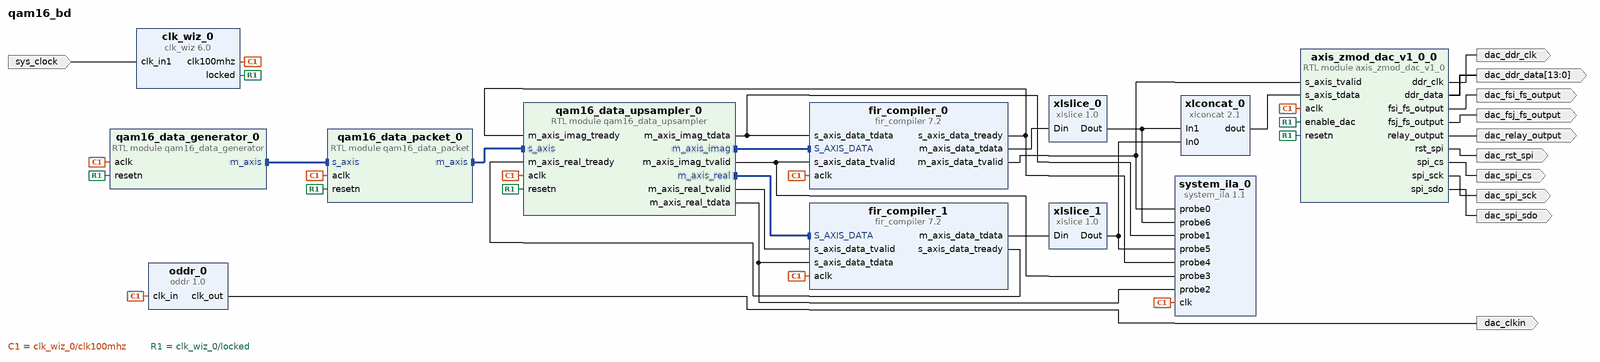
[diagram p0: block diagram of the top level]
# Vivado block design qam16_bd, xc7a100tcsg324-1, Vivado 2022.2
create_bd_design qam16_bd

create_bd_port -dir I -type clk sys_clock
set_property -dict {CONFIG.FREQ_HZ 100000000 CONFIG.PHASE 0.0} [get_bd_ports sys_clock]
create_bd_port -dir O -from 13 -to 0 dac_ddr_data
create_bd_port -dir O -type clk dac_ddr_clk
create_bd_port -dir O dac_rst_spi
create_bd_port -dir O dac_spi_sck
create_bd_port -dir O dac_spi_cs
create_bd_port -dir O dac_spi_sdo
create_bd_port -dir O dac_relay_output
create_bd_port -dir O dac_fsi_fs_output
create_bd_port -dir O dac_fsj_fs_output
create_bd_port -dir O -type clk dac_clkin

create_bd_cell -type ip -vlnv xilinx.com:ip:fir_compiler:7.2 fir_compiler_0
set_property -dict [list \
  CONFIG.BestPrecision true \
  CONFIG.Clock_Frequency 100 \
  CONFIG.CoefficientSource COE_File \
  CONFIG.Coefficient_File ../../../../../../../../../../../workspace/matlab/qam16/rcos_coeff.coe \
  CONFIG.Coefficient_Fractional_Bits 22 \
  CONFIG.Coefficient_Sets 1 \
  CONFIG.Coefficient_Sign Signed \
  CONFIG.Coefficient_Structure Inferred \
  CONFIG.Coefficient_Width 20 \
  CONFIG.Filter_Architecture Systolic_Multiply_Accumulate \
  CONFIG.Output_Rounding_Mode Full_Precision \
  CONFIG.Output_Width 39 \
  CONFIG.Quantization Quantize_Only \
  CONFIG.Sample_Frequency 0.1 \
] [get_bd_cells fir_compiler_0]
create_bd_cell -type ip -vlnv xilinx.com:ip:fir_compiler:7.2 fir_compiler_1
set_property -dict [list \
  CONFIG.BestPrecision true \
  CONFIG.Clock_Frequency 100 \
  CONFIG.CoefficientSource COE_File \
  CONFIG.Coefficient_File ../../../../../../../../../../../workspace/matlab/qam16/rcos_coeff.coe \
  CONFIG.Coefficient_Fractional_Bits 22 \
  CONFIG.Coefficient_Sets 1 \
  CONFIG.Coefficient_Sign Signed \
  CONFIG.Coefficient_Structure Inferred \
  CONFIG.Coefficient_Width 20 \
  CONFIG.Filter_Architecture Systolic_Multiply_Accumulate \
  CONFIG.Output_Rounding_Mode Full_Precision \
  CONFIG.Output_Width 39 \
  CONFIG.Quantization Quantize_Only \
  CONFIG.Sample_Frequency 0.1 \
] [get_bd_cells fir_compiler_1]
create_bd_cell -type ip -vlnv xilinx.com:ip:clk_wiz:6.0 clk_wiz_0
set_property -dict [list \
  CONFIG.CLK_IN1_BOARD_INTERFACE sys_clock \
  CONFIG.CLK_OUT1_PORT clk100mhz \
  CONFIG.USE_BOARD_FLOW true \
  CONFIG.USE_RESET false \
] [get_bd_cells clk_wiz_0]
create_bd_cell -type module -reference qam16_data_packet qam16_data_packet_0
create_bd_cell -type ip -vlnv xilinx.com:ip:system_ila:1.1 system_ila_0
set_property -dict [list \
  CONFIG.C_DATA_DEPTH 16384 \
  CONFIG.C_EN_STRG_QUAL 1 \
  CONFIG.C_MON_TYPE NATIVE \
  CONFIG.C_NUM_OF_PROBES 7 \
  CONFIG.C_PROBE0_TYPE 0 \
  CONFIG.C_PROBE1_TYPE 0 \
  CONFIG.C_PROBE2_TYPE 0 \
  CONFIG.C_PROBE3_TYPE 0 \
  CONFIG.C_PROBE4_TYPE 0 \
  CONFIG.C_PROBE5_TYPE 0 \
  CONFIG.C_PROBE6_TYPE 0 \
] [get_bd_cells system_ila_0]
create_bd_cell -type module -reference qam16_data_generator qam16_data_generator_0
create_bd_cell -type module -reference qam16_data_upsampler qam16_data_upsampler_0
set_property -dict {CONFIG.prescaler_factor 100} [get_bd_cells qam16_data_upsampler_0]
create_bd_cell -type ip -vlnv xilinx.com:ip:xlslice:1.0 xlslice_0
set_property -dict {CONFIG.DIN_FROM 36 CONFIG.DIN_TO 21 CONFIG.DIN_WIDTH 40} [get_bd_cells xlslice_0]
create_bd_cell -type ip -vlnv xilinx.com:ip:xlslice:1.0 xlslice_1
set_property -dict {CONFIG.DIN_FROM 36 CONFIG.DIN_TO 21 CONFIG.DIN_WIDTH 40} [get_bd_cells xlslice_1]
create_bd_cell -type ip -vlnv xilinx.com:ip:xlconcat:2.1 xlconcat_0
create_bd_cell -type ip -vlnv xilinx.com:ip:oddr:1.0 oddr_0
create_bd_cell -type module -reference axis_zmod_dac_v1_0 axis_zmod_dac_v1_0_0

# ---- connections ----

connect_bd_intf_net [get_bd_intf_pins qam16_data_generator_0/m_axis] [get_bd_intf_pins qam16_data_packet_0/s_axis]
connect_bd_intf_net [get_bd_intf_pins qam16_data_packet_0/m_axis] [get_bd_intf_pins qam16_data_upsampler_0/s_axis]
connect_bd_intf_net [get_bd_intf_pins qam16_data_upsampler_0/m_axis_imag] [get_bd_intf_pins fir_compiler_0/S_AXIS_DATA]
connect_bd_intf_net [get_bd_intf_pins qam16_data_upsampler_0/m_axis_real] [get_bd_intf_pins fir_compiler_1/S_AXIS_DATA]
connect_bd_net [get_bd_pins clk_wiz_0/clk100mhz] \
  [get_bd_pins fir_compiler_0/aclk] [get_bd_pins fir_compiler_1/aclk] [get_bd_pins qam16_data_packet_0/aclk] \
  [get_bd_pins system_ila_0/clk] [get_bd_pins qam16_data_generator_0/aclk] [get_bd_pins qam16_data_upsampler_0/aclk] \
  [get_bd_pins oddr_0/clk_in] [get_bd_pins axis_zmod_dac_v1_0_0/aclk]
connect_bd_net [get_bd_pins axis_zmod_dac_v1_0_0/ddr_clk] [get_bd_ports dac_ddr_clk]
connect_bd_net [get_bd_pins axis_zmod_dac_v1_0_0/ddr_data] [get_bd_ports dac_ddr_data]
connect_bd_net [get_bd_pins axis_zmod_dac_v1_0_0/fsi_fs_output] [get_bd_ports dac_fsi_fs_output]
connect_bd_net [get_bd_pins axis_zmod_dac_v1_0_0/fsj_fs_output] [get_bd_ports dac_fsj_fs_output]
connect_bd_net [get_bd_pins axis_zmod_dac_v1_0_0/relay_output] [get_bd_ports dac_relay_output]
connect_bd_net [get_bd_pins axis_zmod_dac_v1_0_0/rst_spi] [get_bd_ports dac_rst_spi]
connect_bd_net [get_bd_pins axis_zmod_dac_v1_0_0/spi_cs] [get_bd_ports dac_spi_cs]
connect_bd_net [get_bd_pins axis_zmod_dac_v1_0_0/spi_sck] [get_bd_ports dac_spi_sck]
connect_bd_net [get_bd_pins axis_zmod_dac_v1_0_0/spi_sdo] [get_bd_ports dac_spi_sdo]
connect_bd_net [get_bd_pins clk_wiz_0/locked] \
  [get_bd_pins qam16_data_packet_0/resetn] [get_bd_pins qam16_data_generator_0/resetn] \
  [get_bd_pins qam16_data_upsampler_0/resetn] [get_bd_pins axis_zmod_dac_v1_0_0/resetn] \
  [get_bd_pins axis_zmod_dac_v1_0_0/enable_dac]
connect_bd_net -net fir_compiler_0_s_axis_data_tready [get_bd_pins fir_compiler_0/s_axis_data_tready] \
  [get_bd_pins qam16_data_upsampler_0/m_axis_imag_tready] [get_bd_pins system_ila_0/probe4]
connect_bd_net [get_bd_pins fir_compiler_1/s_axis_data_tready] [get_bd_pins qam16_data_upsampler_0/m_axis_real_tready]
connect_bd_net -net m_axis_data_tdata [get_bd_pins fir_compiler_0/m_axis_data_tdata] [get_bd_pins xlslice_0/Din]
connect_bd_net -net m_axis_data_tdata_1 [get_bd_pins fir_compiler_1/m_axis_data_tdata] [get_bd_pins xlslice_1/Din]
connect_bd_net -net m_axis_data_tvalid [get_bd_pins fir_compiler_0/m_axis_data_tvalid] \
  [get_bd_pins system_ila_0/probe0] [get_bd_pins axis_zmod_dac_v1_0_0/s_axis_tvalid]
connect_bd_net -net m_axis_imag_tdata [get_bd_pins qam16_data_upsampler_0/m_axis_imag_tdata] \
  [get_bd_pins fir_compiler_0/s_axis_data_tdata] [get_bd_pins system_ila_0/probe1]
connect_bd_net -net m_axis_real_tdata [get_bd_pins qam16_data_upsampler_0/m_axis_real_tdata] \
  [get_bd_pins fir_compiler_1/s_axis_data_tdata] [get_bd_pins system_ila_0/probe2]
connect_bd_net [get_bd_pins oddr_0/clk_out] [get_bd_ports dac_clkin]
connect_bd_net -net qam16_data_upsampler_0_m_axis_imag_tvalid [get_bd_pins qam16_data_upsampler_0/m_axis_imag_tvalid] \
  [get_bd_pins fir_compiler_0/s_axis_data_tvalid] [get_bd_pins system_ila_0/probe3]
connect_bd_net [get_bd_pins qam16_data_upsampler_0/m_axis_real_tvalid] [get_bd_pins fir_compiler_1/s_axis_data_tvalid]
connect_bd_net [get_bd_ports sys_clock] [get_bd_pins clk_wiz_0/clk_in1]
connect_bd_net [get_bd_pins xlconcat_0/dout] [get_bd_pins axis_zmod_dac_v1_0_0/s_axis_tdata]
connect_bd_net -net xlslice_0_Dout [get_bd_pins xlslice_0/Dout] [get_bd_pins system_ila_0/probe6] [get_bd_pins xlconcat_0/In1]
connect_bd_net -net xlslice_1_Dout [get_bd_pins xlslice_1/Dout] [get_bd_pins system_ila_0/probe5] [get_bd_pins xlconcat_0/In0]
set_property HDL_ATTRIBUTE.DEBUG true [get_bd_nets fir_compiler_0_s_axis_data_tready]
set_property HDL_ATTRIBUTE.MARK_DEBUG true [get_bd_nets fir_compiler_0_s_axis_data_tready]
set_property HDL_ATTRIBUTE.DEBUG true [get_bd_nets m_axis_data_tvalid]
set_property HDL_ATTRIBUTE.MARK_DEBUG true [get_bd_nets m_axis_data_tvalid]
set_property HDL_ATTRIBUTE.DEBUG true [get_bd_nets m_axis_imag_tdata]
set_property HDL_ATTRIBUTE.MARK_DEBUG true [get_bd_nets m_axis_imag_tdata]
set_property HDL_ATTRIBUTE.DEBUG true [get_bd_nets m_axis_real_tdata]
set_property HDL_ATTRIBUTE.MARK_DEBUG true [get_bd_nets m_axis_real_tdata]
set_property HDL_ATTRIBUTE.DEBUG true [get_bd_nets qam16_data_upsampler_0_m_axis_imag_tvalid]
set_property HDL_ATTRIBUTE.MARK_DEBUG true [get_bd_nets qam16_data_upsampler_0_m_axis_imag_tvalid]
set_property HDL_ATTRIBUTE.DEBUG true [get_bd_nets xlslice_0_Dout]
set_property HDL_ATTRIBUTE.MARK_DEBUG true [get_bd_nets xlslice_0_Dout]
set_property HDL_ATTRIBUTE.DEBUG true [get_bd_nets xlslice_1_Dout]
set_property HDL_ATTRIBUTE.MARK_DEBUG true [get_bd_nets xlslice_1_Dout]

validate_bd_design
save_bd_design
